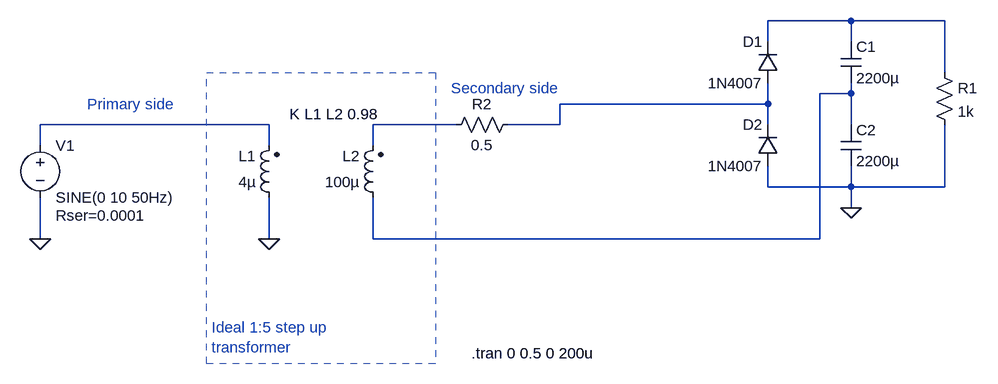
[diagram p0: schematic AC_DC_doubler_voltage.asc]
AC_DC_doubler_voltage.asc, the LTspice schematic file:
Version 4
SHEET 1 916 680
WIRE 720 -80 592 -80
WIRE 864 -80 720 -80
WIRE 592 -48 592 -80
WIRE 720 -48 720 -80
WIRE 864 0 864 -80
WIRE 720 32 720 16
WIRE 720 32 672 32
WIRE 592 48 592 16
WIRE 592 48 272 48
WIRE -176 80 -528 80
WIRE 112 80 -16 80
WIRE 272 80 272 48
WIRE 272 80 192 80
WIRE 592 80 592 48
WIRE 720 80 720 32
WIRE -528 112 -528 80
WIRE -176 112 -176 80
WIRE -16 112 -16 80
WIRE 592 176 592 144
WIRE 720 176 720 144
WIRE 720 176 592 176
WIRE 864 176 864 80
WIRE 864 176 720 176
WIRE 720 208 720 176
WIRE -528 256 -528 192
WIRE -176 256 -176 192
WIRE -16 256 -16 192
WIRE 672 256 672 32
WIRE 672 256 -16 256
FLAG -528 256 0
FLAG -176 256 0
FLAG 720 208 0
SYMBOL ind2 -160 208 R180
WINDOW 0 36 80 Left 2
WINDOW 3 36 40 Left 2
SYMATTR InstName L1
SYMATTR Value 4µ
SYMATTR Type ind
SYMBOL ind2 0 208 R180
WINDOW 0 36 80 Left 2
WINDOW 3 36 40 Left 2
SYMATTR InstName L2
SYMATTR Value 100µ
SYMATTR Type ind
SYMBOL voltage -528 96 R0
WINDOW 123 0 0 Left 2
WINDOW 39 24 124 Left 2
SYMATTR SpiceLine Rser=0.0001
SYMATTR InstName V1
SYMATTR Value SINE(0 10 50Hz)
SYMBOL Diode 608 16 R180
WINDOW 0 24 64 Left 2
WINDOW 3 24 0 Left 2
SYMATTR InstName D1
SYMATTR Value 1N4007
SYMBOL Diode 608 144 R180
WINDOW 0 24 64 Left 2
WINDOW 3 24 0 Left 2
SYMATTR InstName D2
SYMATTR Value 1N4007
SYMBOL Cap 704 -48 R0
SYMATTR InstName C1
SYMATTR Value 2200µ
SYMBOL Cap 704 80 R0
SYMATTR InstName C2
SYMATTR Value 2200µ
SYMBOL Res 848 -16 R0
SYMATTR InstName R1
SYMATTR Value 1k
SYMBOL Res 208 64 R90
WINDOW 0 0 56 VBottom 2
WINDOW 3 32 56 VTop 2
SYMATTR InstName R2
SYMATTR Value 0.5
TEXT -144 64 Left 2 !K L1 L2 0.98
TEXT -264 392 Left 2 ;Ideal 1:5 step up\ntransformer
TEXT -456 48 Left 2 ;Primary side
TEXT 104 24 Left 2 ;Secondary side
TEXT 136 432 Left 2 !.tran 0 0.5 0 200u
RECTANGLE Normal 80 448 -272 0 2

The netlist it stands for:
* AC_DC_doubler_voltage.asc
L1 0 N004 4µ
L2 N002 N005 100µ
V1 N004 0 SINE(0 10 50Hz) Rser=0.0001
D1 N003 N001 1N4007
D2 0 N003 1N4007
C1 N001 N002 2200µ
C2 N002 0 2200µ
R1 N001 0 1k
R2 N003 N005 0.5
.model D D
.lib standard.dio
K L1 L2 0.98
* Ideal 1:5 step up
* transformer
* Primary side
* Secondary side
.tran 0 0.5 0 200u
.backanno
.end